# EAGLE board bms_ver0.2 (EAGLE 7.7.0), part 1 of 2
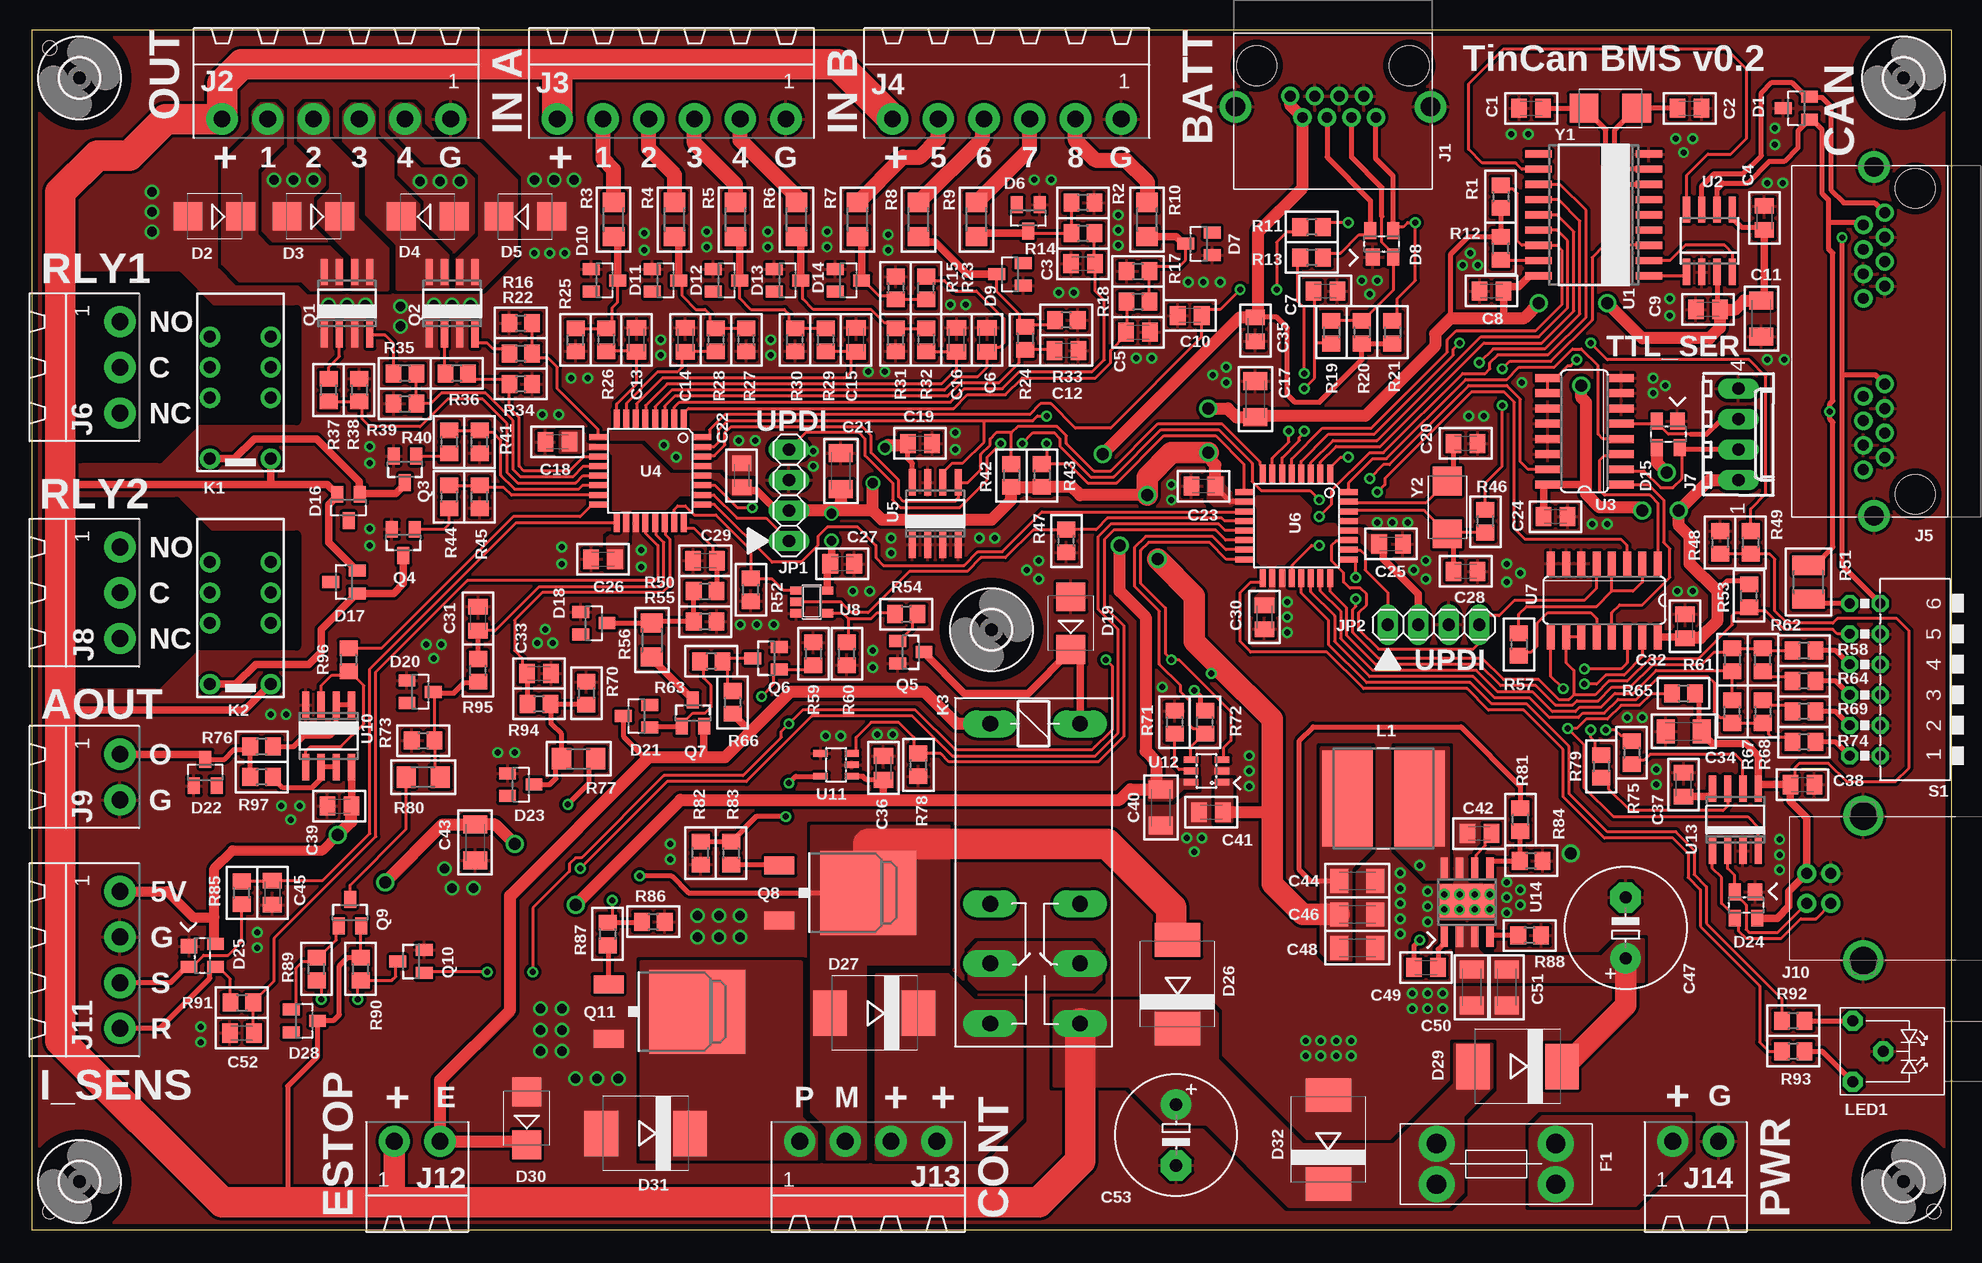
[diagram p5: board, top side]
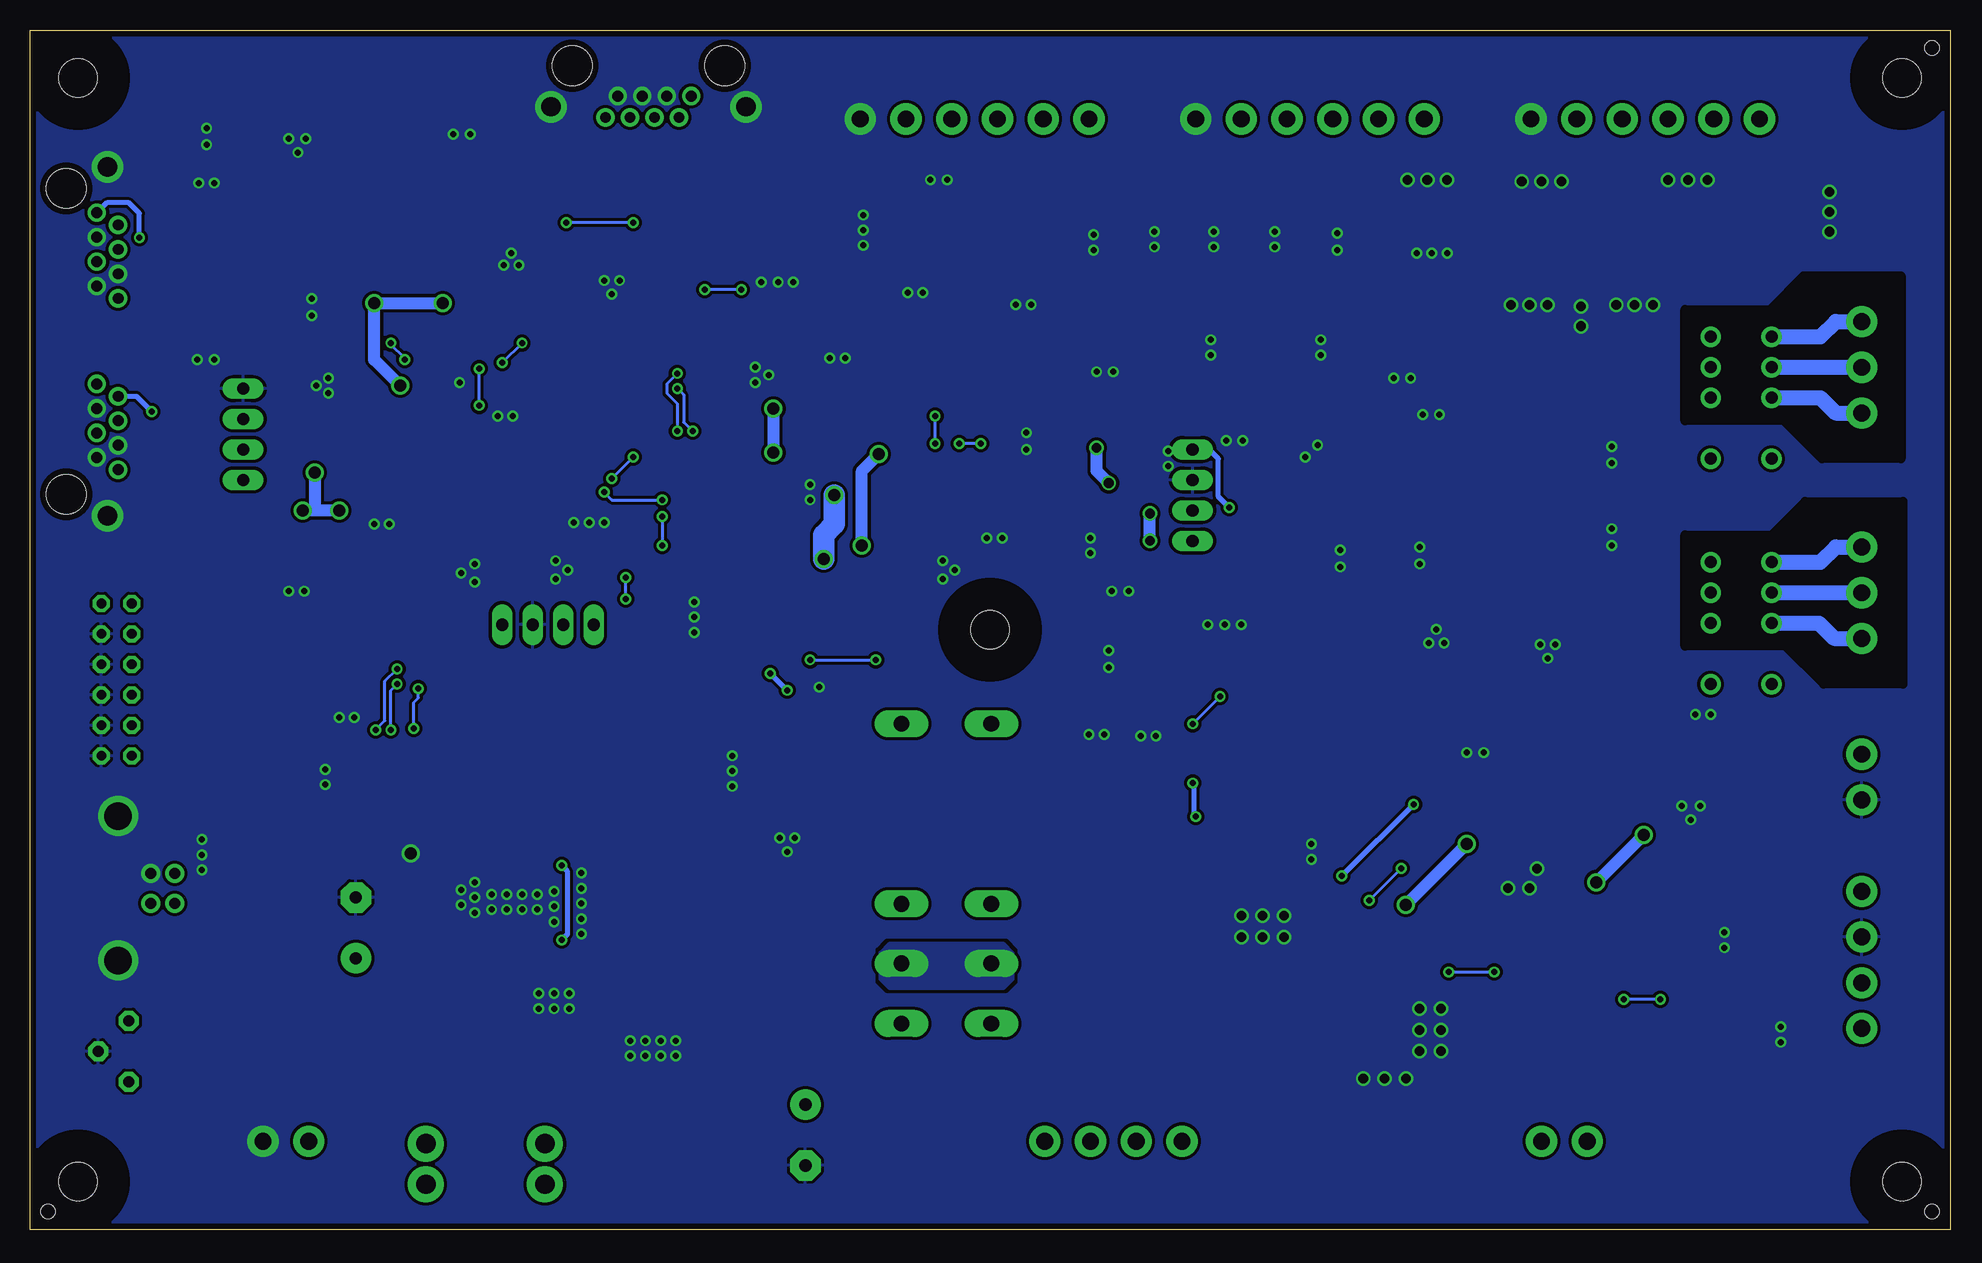
[diagram p6: board, bottom side, seen from below]

Size 160 x 100 mm. Coordinates in mm from the lower left corner, seen from the top.
Outline: 0,0 160,0 160,100 0,100 0,0
Copper layers (1*16): Top 0.035mm / dielectric 1.6mm / Bottom 0.035mm
Design rules "m_": minimum track width 8mil, minimum drill 12mil, track to track 9mil, track to pad 9mil, pad to pad 9mil, via to via 9mil, smd to smd 0mil, copper to edge 20mil, drill to drill 10mil, minimum pad ring 12mil, minimum via ring 8mil, stop-mask expansion 2mil, vias tented up to drill 0mil, thermal gap 10mil
Holes 1.15 mm at 158.5,1.5 1.5,98.5 1.5,1.5
tRestrict: 16 lines
bRestrict: 16 lines

## Footprints (pad centres in the part's own frame; a part is rotated, then mirrored left to right if it is on the bottom)
C0805K = smd 1.3 x 1.6: 1 -1,0; 2 1,0
C1206K = smd 1.5 x 2: 1 -1.5,0; 2 1.5,0
E5-10,5 = drill 1.016 pad 2.54: + -2.54,0 | drill 1.016 pad 2.54 octagon: - 2.54,0
SOT23 = smd 1 x 1.4: 1 -0.95,-1.1; 2 0.95,-1.1; 3 0,1.1
SMB = smd 2.4 x 2.4: A 2.2,0; C -2.2,0
SOT143 = smd 1.2 x 1.4: 1 -0.75,-1.1 | smd 1 x 1.4: 2 0.95,-1.1; 3 0.95,1.1; 4 -0.95,1.1
SMC = smd 2.8 x 3.8: A 3.7,0; C -3.7,0
3568 = drill 1.6 pad 3: 1A -4.96,1.7; 1B -4.96,-1.7; 2A 4.96,1.7; 2B 4.96,-1.7
3,2 = hole 3.2: 0,0
P-RJHSE = drill 0.9: 1 3.56,2.54; 2 2.54,4.32; 3 1.52,2.54; 4 0.5,4.32; 5 -0.52,2.54; 6 -1.54,4.32; 7 -2.56,2.54; 8 -3.58,4.32 | drill 1.6: S1 -8.13,3.43; S2 8.13,3.43 | hole 3.3: -6.35,0; 6.35,0
WJ15EDGRC-3.81-6 = drill 1.4 pad 2.6: 1 -9.525,0; 2 -5.715,0; 3 -1.905,0; 4 1.905,0; 5 5.715,0; 6 9.525,0
P-RJE39-288-1X00 = drill 0.9: 1L -3.555,2.54; 1R 10.725,2.54; 2L -4.575,4.32; 2R 9.705,4.32; 3L -5.595,2.54; 3R 8.685,2.54; 4L -6.615,4.32; 4R 7.665,4.32; 5L -7.635,2.54; 5R 6.645,2.54; 6L -8.655,4.32; 6R 5.625,4.32; 7L -9.675,2.54; 7R 4.605,2.54; 8L -10.695,4.32; 8R 3.585,4.32 | drill 1.6: S1 -14.535,3.43; S2 14.535,3.43 | hole 3.3: -12.755,0; 12.755,0
WJ15EDGRC-3.81-3 = drill 1.4 pad 2.6: 1 -3.81,0; 2 0,0; 3 3.81,0
6410-04 = drill 1.016 long: 1 3.81,0; 2 1.27,0; 3 -1.27,0; 4 -3.81,0
WJ15EDGRC-3.81-2 = drill 1.4 pad 2.6: 1 -1.905,0; 2 1.905,0
85-32004-00X = drill 0.92: 1 4.71,-1.25; 2 4.71,1.25; 3 2.71,1.25; 4 2.71,-1.25 | drill 2.3: M1 0,6.02; M2 0,-6.02
WJ15EDGRC-3.81-4 = drill 1.4 pad 2.6: 1 -5.715,0; 2 -1.905,0; 3 1.905,0; 4 5.715,0
1X04 = drill 1.016 long: 1 -3.81,0; 2 -1.27,0; 3 1.27,0; 4 3.81,0
TXD2 = drill 1: 1 -6.35,-2.54; 3 -1.27,-2.54; 4 1.27,-2.54; 5 3.81,-2.54; 8 3.81,2.54; 9 1.27,2.54; 10 -1.27,2.54; 12 -6.35,2.54
G2R2 = drill 1.321 long: 1 -2.54,-3.683; 2 -2.54,3.81; O1 12.471,3.81; O2 12.471,-3.683; P1 17.45,3.81; P2 17.45,-3.683; S1 22.454,3.81; S2 22.454,-3.683
DEM8045Z = smd 4.2 x 8: 1 -3,0; 2 3,0
WP59BL = drill 0.9 pad 1.676 octagon: 1 2.54,-2.54; 2 0,0; 3 -2.54,-2.54
SO-08 = smd 0.6 x 2.2: 1 -1.905,-2.6; 2 -0.635,-2.6; 3 0.635,-2.6; 4 1.905,-2.6; 5 1.905,2.6; 6 0.635,2.6; 7 -0.635,2.6; 8 -1.905,2.6
D-PAK_TO252AA = smd 1.5 x 2.5: 1 -2.28,-6.9; 3 2.28,-6.9 | smd 7 x 8: 4 0,0.5
R0805 = smd 1.3 x 1.5: 1 -0.95,0; 2 0.95,0
R1206 = smd 1.6 x 1.803: 1 -1.422,0; 2 1.422,0
R1210 = smd 1.6 x 2.7: 1 -1.4,0; 2 1.4,0
DA-06 = drill 0.813 octagon: 1 -6.35,-1.27; 2 -3.81,-1.27; 3 -1.27,-1.27; 4 1.27,-1.27; 5 3.81,-1.27; 6 6.35,-1.27; 7 6.35,1.27; 8 3.81,1.27; 9 1.27,1.27; 10 -1.27,1.27; 11 -3.81,1.27; 12 -6.35,1.27
SO-18DW = smd 0.6 x 2.2: 1 -5.08,-4.6; 2 -3.81,-4.6; 3 -2.54,-4.6; 4 -1.27,-4.6; 5 0,-4.6; 6 1.27,-4.6; 7 2.54,-4.6; 8 3.81,-4.6; 9 5.08,-4.6; 10 5.08,4.6; 11 3.81,4.6; 12 2.54,4.6; 13 1.27,4.6; 14 0,4.6; 15 -1.27,4.6; 16 -2.54,4.6; 17 -3.81,4.6; 18 -5.08,4.6
SO16 = smd 0.66 x 2.032: 1 -4.445,-3.073; 2 -3.175,-3.073; 3 -1.905,-3.073; 4 -0.635,-3.073; 5 0.635,-3.073; 6 1.905,-3.073; 7 3.175,-3.073; 8 4.445,-3.073; 9 4.445,3.073; 10 3.175,3.073; 11 1.905,3.073; 12 0.635,3.073; 13 -0.635,3.073; 14 -1.905,3.073; 15 -3.175,3.073; 16 -4.445,3.073
TQFP32-08 = smd 1.5 x 0.5: 1 -4.35,2.8; 2 -4.35,2; 3 -4.35,1.2; 4 -4.35,0.4; 5 -4.35,-0.4; 6 -4.35,-1.2; 7 -4.35,-2; 8 -4.35,-2.8; 17 4.35,-2.8; 18 4.35,-2; 19 4.35,-1.2; 20 4.35,-0.4; 21 4.35,0.4; 22 4.35,1.2; 23 4.35,2; 24 4.35,2.8 | smd 0.5 x 1.5: 9 -2.8,-4.35; 10 -2,-4.35; 11 -1.2,-4.35; 12 -0.4,-4.35; 13 0.4,-4.35; 14 1.2,-4.35; 15 2,-4.35; 16 2.8,-4.35; 25 2.8,4.35; 26 2,4.35; 27 1.2,4.35; 28 0.4,4.35; 29 -0.4,4.35; 30 -1.2,4.35; 31 -2,4.35; 32 -2.8,4.35
SOT23-5 = smd 0.69 x 0.99: 1 -0.95,-1.29; 2 0,-1.29; 3 0.95,-1.29; 4 0.95,1.3; 5 -0.95,1.3
SO08 = smd 0.6 x 2.2: 1 -1.905,-2.6; 2 -0.635,-2.6; 3 0.635,-2.6; 4 1.905,-2.6; 5 1.905,2.6; 6 0.635,2.6; 7 -0.635,2.6; 8 -1.905,2.6
SOT23-5L = smd 0.55 x 1.2: 1 -0.95,-1.3; 2 0,-1.3; 3 0.95,-1.3; 4 0.95,1.3; 5 -0.95,1.3
SOT23-6L = smd 0.55 x 1.2: 1 -0.95,-1.3; 2 0,-1.3; 3 0.95,-1.3; 4 0.95,1.3; 5 0,1.3; 6 -0.95,1.3
SO08-EP = smd 0.61 x 1.91: 1 -1.905,-2.78; 2 -0.635,-2.78; 3 0.635,-2.78; 4 1.905,-2.78; 5 1.905,2.78; 6 0.635,2.78; 7 -0.635,2.78; 8 -1.905,2.78 | smd 4.9 x 3: PAD 0,0
CRYSTAL-TXC-7A = smd 2.4 x 2.4: P$1 2.2,0; P$2 -2.2,0

## Placement (x,y rotation side)
C1  15p  [C0805K]  124.97,93.47 180 top
C2  15p  [C0805K]  138.18,93.47 0 top
C3  100n  [C0805K]  87.63,80.52 180 top
C4  100n  [C0805K]  144.4,84.33 90 top
C5  100n  [C0805K]  92.2,74.8 0 top
C6  100n  [C0805K]  79.63,74.17 90 top
C7  47p  [C0805K]  107.82,78.23 0 top
C8  100n  [C0805K]  121.67,78.23 180 top
C9  100n  [C0805K]  139.7,76.71 180 top
C10  100n  [C0805K]  96.52,76.2 180 top
C11  10u  [C1206K]  144.15,75.95 270 top
C12  100n  [C0805K]  86.23,73.28 0 top
C13  100n  [C0805K]  50.42,74.17 90 top
C14  100n  [C0805K]  54.48,74.17 90 top
C15  100n  [C0805K]  68.71,74.17 90 top
C16  100n  [C0805K]  77.09,74.17 90 top
C17  10u  [C1206K]  101.98,69.22 90 top
C18  100n  [C0805K]  43.81,65.66 180 top
C19  100n  [C0805K]  74.04,65.53 0 top
C20  15p  [C0805K]  119.51,65.53 0 top
C21  10u  [C1206K]  67.44,63.25 90 top
C22  100n  [C0805K]  59.18,62.87 90 top
C23  100n  [C0805K]  97.66,61.98 180 top
C24  100n  [C0805K]  127,59.44 0 top
C25  100n  [C0805K]  113.28,57.15 0 top
C26  100n  [C0805K]  47.62,55.88 180 top
C27  100n  [C0805K]  67.56,55.5 0 top
C28  15p  [C0805K]  119.51,54.86 0 top
C29  100n  [C0805K]  56.13,55.75 180 top
C30  100n  [C0805K]  102.74,51.05 270 top
C31  100n  [C0805K]  37.21,50.93 90 top
C32  100n  [C0805K]  137.79,50.29 90 top
C33  100n  [C0805K]  42.29,46.35 0 top
C34  10u  [C1206K]  137.67,41.53 180 top
C35  100n  [C0805K]  101.98,75.06 270 top
C36  100n  [C0805K]  70.99,38.48 90 top
C37  100n  [C0805K]  137.67,37.08 90 top
C38  100n  [C0805K]  147.57,37.08 0 top
C39  100n  [C0805K]  25.65,35.31 180 top
C40  10u  [C1206K]  94.11,35.18 270 top
C41  100n  [C0805K]  98.3,34.8 180 top
C42  10n  [C0805K]  120.65,33.02 180 top
C43  10u  [C1206K]  36.96,32.26 270 top
C44  22u/10  [C1206K]  110.49,29.08 0 top
C45  100n  [C0805K]  20.07,28.07 270 top
C46  22u/10  [C1206K]  110.49,26.29 0 top
C47  470µ/35  [E5-10,5]  132.84,25.15 90 top
C48  22u/10  [C1206K]  110.49,23.5 0 top
C49  100n  [C0805K]  116.2,21.84 180 top
C50  10u/50  [C1206K]  120.02,20.19 270 top
C51  10u/50  [C1206K]  122.94,20.19 270 top
C52  100n  [C0805K]  17.53,16.38 180 top
C53  470µ/35  [E5-10,5]  95.38,7.87 270 top
D1  PESD2CAN  [SOT23]  147.07,93.47 90 top
D2  SMBJ26A  [SMB]  15.24,84.45 180 top
D3  SMBJ26A  [SMB]  23.5,84.45 180 top
D4  SMBJ26A  [SMB]  33.02,84.45 0 top
D5  SMBJ26A  [SMB]  41.15,84.45 0 top
D6  BZX84C6V2LT1G  [SOT23]  83.06,84.33 180 top
D7  BZX84C6V2LT1G  [SOT23]  97.28,82.17 90 top
D8  SP0503BAHTG  [SOT143]  112.52,82.17 0 top
D9  BZX84C6V2LT1G  [SOT23]  81.53,79.63 90 top
D10  BZX84C6V2LT1G  [SOT23]  47.75,79.12 270 top
D11  BZX84C6V2LT1G  [SOT23]  52.83,79.12 270 top
D12  BZX84C6V2LT1G  [SOT23]  57.91,79.12 270 top
D13  BZX84C6V2LT1G  [SOT23]  62.99,79.12 270 top
D14  BZX84C6V2LT1G  [SOT23]  68.07,79.12 270 top
D15  SP0503BAHTG  [SOT143]  136.4,66.29 180 top
D16  BAV99  [SOT23]  26.42,60.2 180 top
D17  BAV99  [SOT23]  26.04,53.98 90 top
D18  BZX84C6V2LT1G  [SOT23]  46.86,50.55 270 top
D19  SMBJ26A  [SMB]  86.61,50.55 90 top
D20  BZX84C6V2LT1G  [SOT23]  32.38,44.83 270 top
D21  BZX84C15LT1G  [SOT23]  50.42,42.8 90 top
D22  BZX84C6V2LT1G  [SOT23]  14.48,38.1 0 top
D23  BZX84C6V2LT1G  [SOT23]  40.77,37.08 270 top
D24  SP0503BAHTG  [SOT143]  142.88,27.05 180 top
D25  SP0503BAHTG  [SOT143]  14.22,22.86 270 top
D26  B340-13-F  [SMC]  95.5,20.45 90 top
D27  SMCJ43CA  [SMC]  70.23,18.03 180 top
D28  BZX84C15LT1G  [SOT23]  22.73,17.4 270 top
D29  B340-13-F  [SMC]  123.83,13.59 180 top
D30  SMBJ26A  [SMB]  41.27,9.27 90 top
D31  SMCJ43CA  [SMC]  51.18,8 180 top
D32  SMCJ20A  [SMC]  108.08,7.49 90 top
F1  [3568]  122.05,5.46 180 top
H1  MOUNT-HOLE3.2  [3,2]  4,96 0 top
H2  MOUNT-HOLE3.2  [3,2]  156,96 0 top
H3  MOUNT-HOLE3.2  [3,2]  80,50 0 top
H4  MOUNT-HOLE3.2  [3,2]  4,4 0 top
H5  MOUNT-HOLE3.2  [3,2]  156,4 0 top
J1  P-RJHSE  [P-RJHSE]  108.46,97.03 180 top
J2  WJ15EDGRC-6  [WJ15EDGRC-3.81-6]  25.4,92.58 180 top
J3  WJ15EDGRC-6  [WJ15EDGRC-3.81-6]  53.34,92.58 180 top
J4  WJ15EDGRC-6  [WJ15EDGRC-3.81-6]  81.28,92.58 180 top
J5  P-RJE39-288-1X00  [P-RJE39-288-1X00]  156.97,74.04 90 top
J6  WJ15EDGRC-3  [WJ15EDGRC-3.81-3]  7.37,71.88 270 top
J7  22-27-2041-04  [6410-04]  142.24,66.29 270 top
J8  WJ15EDGRC-3  [WJ15EDGRC-3.81-3]  7.37,53.09 270 top
J9  WJ15EDGRC-2  [WJ15EDGRC-3.81-2]  7.37,37.72 270 top
J10  MINI-USB_SHIELD4P-85-32004-00X  [85-32004-00X]  152.65,28.45 180 top
J11  WJ15EDGRC-4  [WJ15EDGRC-3.81-4]  7.37,22.48 270 top
J12  WJ15EDGRC-2  [WJ15EDGRC-3.81-2]  32.13,7.37 0 top
J13  WJ15EDGRC-4  [WJ15EDGRC-3.81-4]  69.72,7.37 0 top
J14  WJ15EDGRC-2  [WJ15EDGRC-3.81-2]  138.68,7.37 0 top
JP1  UPDI  [1X04]  63.12,61.21 90 top
JP2  UPDI  [1X04]  116.84,50.42 0 top
K1  G6S-2-12V  [TXD2]  17.4,70.61 90 top
K2  G6S-2-12V  [TXD2]  17.4,51.82 90 top
K3  G2RL-2-DC12  [G2R2]  83.57,39.62 270 top
L1  DEM8045Z  [DEM8045Z]  112.65,35.94 180 top
LED1  WP59BL  [WP59BL]  154.31,14.86 270 top
Q1  ZXMS6004DN8  [SO-08]  26.29,77.22 0 top
Q2  ZXMS6004DN8  [SO-08]  35.05,77.22 0 top
Q3  2N7002  [SOT23]  31.11,63.37 180 top
Q4  2N7002  [SOT23]  30.99,57.28 180 top
Q5  2N7002  [SOT23]  73.28,48.13 270 top
Q6  2N7002  [SOT23]  61.21,47.62 90 top
Q7  BSS84  [SOT23]  55.12,43.05 0 top
Q8  AOD66923  [D-PAK_TO252AA]  69.22,28.07 270 top
Q9  BSS84  [SOT23]  26.54,26.42 0 top
Q10  2N7002  [SOT23]  31.62,22.35 90 top
Q11  AOD66923  [D-PAK_TO252AA]  54.99,18.16 270 top
R1  10k  [R0805]  122.43,86.11 270 top
R2  1k2  [R0805]  87.63,85.6 180 top
R3  4k7  [R1206]  48.51,84.2 270 top
R4  4k7  [R1206]  53.59,84.2 270 top
R5  4k7  [R1206]  58.67,84.2 270 top
R6  4k7  [R1206]  63.75,84.2 270 top
R7  4k7  [R1206]  68.83,84.2 270 top
R8  4k7  [R1206]  73.91,84.2 270 top
R9  4k7  [R1206]  78.74,84.2 270 top
R10  4k7  [R1206]  92.96,84.2 270 top
R11  1k  [R0805]  106.68,83.57 180 top
R12  10k  [R0805]  122.43,81.79 90 top
R13  47R  [R0805]  106.68,81.03 180 top
R14  1k  [R0805]  87.63,83.06 0 top
R15  1k2  [R0805]  72.01,78.49 270 top
R16  10k  [R0805]  40.77,75.56 0 top
R17  1k2  [R0805]  92.2,79.88 0 top
R18  1k  [R0805]  92.2,77.34 180 top
R19  1k  [R0805]  108.33,74.8 270 top
R20  10k  [R0805]  110.87,74.8 270 top
R21  10k  [R0805]  113.41,74.8 270 top
R22  1k  [R0805]  40.77,73.03 180 top
R23  1k  [R0805]  74.55,78.49 90 top
R24  1k  [R0805]  82.8,74.3 270 top
R25  1k2  [R0805]  45.34,74.17 90 top
R26  1k  [R0805]  47.88,74.17 270 top
R27  1k2  [R0805]  59.56,74.17 90 top
R28  1k  [R0805]  57.02,74.17 270 top
R29  1k  [R0805]  66.17,74.17 270 top
R30  1k2  [R0805]  63.63,74.17 90 top
R31  1k2  [R0805]  72.01,74.17 90 top
R32  1k  [R0805]  74.55,74.17 270 top
R33  1k2  [R0805]  86.23,75.82 180 top
R34  10k  [R0805]  40.77,70.48 180 top
R35  1k  [R0805]  31.11,71.37 180 top
R36  1k  [R0805]  35.43,71.37 180 top
R37  1k  [R0805]  24.77,69.98 90 top
R38  10k  [R0805]  27.3,69.98 270 top
R39  10k  [R0805]  31.11,68.83 0 top
R40  1k  [R0805]  34.8,65.66 270 top
R41  10k  [R0805]  37.34,65.66 90 top
R42  10k  [R0805]  81.66,62.87 270 top
R43  10k  [R0805]  84.2,62.87 270 top
R44  1k  [R0805]  34.8,61.09 270 top
R45  10k  [R0805]  37.34,61.09 90 top
R46  DNP  [R0805]  121.16,59.05 90 top
R47  10k  [R0805]  86.23,57.4 90 top
R48  10k  [R0805]  140.72,57.28 270 top
R49  10k  [R0805]  143.26,57.28 270 top
R50  1k  [R0805]  56.13,53.21 0 top
R51  120R  [R1210]  148.08,53.98 90 top
R52  10k  [R0805]  59.94,53.34 90 top
R53  10k  [R0805]  143.13,52.83 90 top
R54  1k  [R0805]  72.9,51.31 0 top
R55  1k2  [R0805]  56.13,50.67 180 top
R56  4k7  [R1206]  51.69,49.15 90 top
R57  1k  [R0805]  123.95,48.77 270 top
R58  10k  [R0805]  147.7,48.26 180 top
R59  10k  [R0805]  65.15,48.01 270 top
R60  10k  [R0805]  67.94,48.01 90 top
R61  10k  [R0805]  141.73,47.5 270 top
R62  10k  [R0805]  144.27,47.5 90 top
R63  10k  [R0805]  56.64,47.37 180 top
R64  10k  [R0805]  147.7,45.72 180 top
R65  10k  [R0805]  137.67,44.7 0 top
R66  10k  [R0805]  58.42,43.94 270 top
R67  10k  [R0805]  141.73,43.18 90 top
R68  10k  [R0805]  144.27,43.18 270 top
R69  10k  [R0805]  147.7,43.18 180 top
R70  1k2  [R0805]  46.23,44.7 270 top
R71  49k9  [R0805]  95.25,42.29 270 top
R72  10k  [R0805]  97.79,42.29 90 top
R73  1k2  [R0805]  32.64,40.77 0 top
R74  10k  [R0805]  147.7,40.64 180 top
R75  1k  [R0805]  133.35,39.75 270 top
R76  47R  [R0805]  19.18,40.26 180 top
R77  4k7  [R1206]  45.59,39.24 180 top
R78  10k  [R0805]  73.91,38.73 90 top
R79  1k  [R0805]  130.81,38.61 270 top
R80  4k7  [R1206]  32.64,37.72 0 top
R81  51k  [R0805]  124.08,34.16 90 top
R82  10k  [R0805]  55.75,31.37 90 top
R83  47R  [R0805]  58.29,31.37 270 top
R84  10k  [R0805]  124.97,30.73 180 top
R85  1k  [R0805]  17.53,28.07 90 top
R86  10k  [R0805]  51.82,25.65 180 top
R87  1k  [R0805]  48.01,24.64 270 top
R88  200k  [R0805]  124.84,24.51 180 top
R89  10k  [R0805]  23.75,21.72 90 top
R90  10k  [R0805]  27.43,21.72 90 top
R91  1k  [R0805]  17.53,18.92 0 top
R92  1k  [R0805]  146.81,17.4 180 top
R93  1k  [R0805]  146.81,14.86 180 top
R94  1k  [R0805]  42.29,43.81 180 top
R95  1k  [R0805]  37.21,46.61 90 top
R96  1k  [R0805]  26.42,47.5 270 top
R97  47R  [R0805]  19.18,37.72 180 top
S1  [DA-06]  152.78,45.85 90 top
U1  MCP2515-SO  [SO-18DW]  130.18,84.58 90 top
U2  MCP2562-SN  [SO-08]  139.83,82.42 0 top
U3  74HC4053D  [SO16]  129.41,66.55 90 top
U4  AVR64DD32-I/PT  [TQFP32-08]  51.56,63.25 270 top
U5  AT24C256C-SSHL-T  [SO-08]  75.31,59.69 0 top
U6  AVR64DD32-I/PT  [TQFP32-08]  105.41,58.67 270 top
U7  74HC4053D  [SO16]  131.06,52.45 180 top
U8  74AHC1G08DBV  [SOT23-5]  65.02,52.32 270 top
U10  MCP6002  [SO08]  24.77,41.15 180 top
U11  UCC27517  [SOT23-5L]  67.06,38.73 90 top
U12  AP2553  [SOT23-6L]  97.92,38.23 90 top
U13  CH340N  [SO-08]  141.99,34.16 0 top
U14  AP64102  [SO08-EP]  119.63,27.3 0 top
Y1  G5320000122080  [CRYSTAL-TXC-7A]  131.57,93.47 0 top
Y2  G5320000122080  [CRYSTAL-TXC-7A]  117.98,60.2 90 top